# EAGLE schematic nrf52840_four_input_minew_module_v01 (EAGLE 7.7.0)
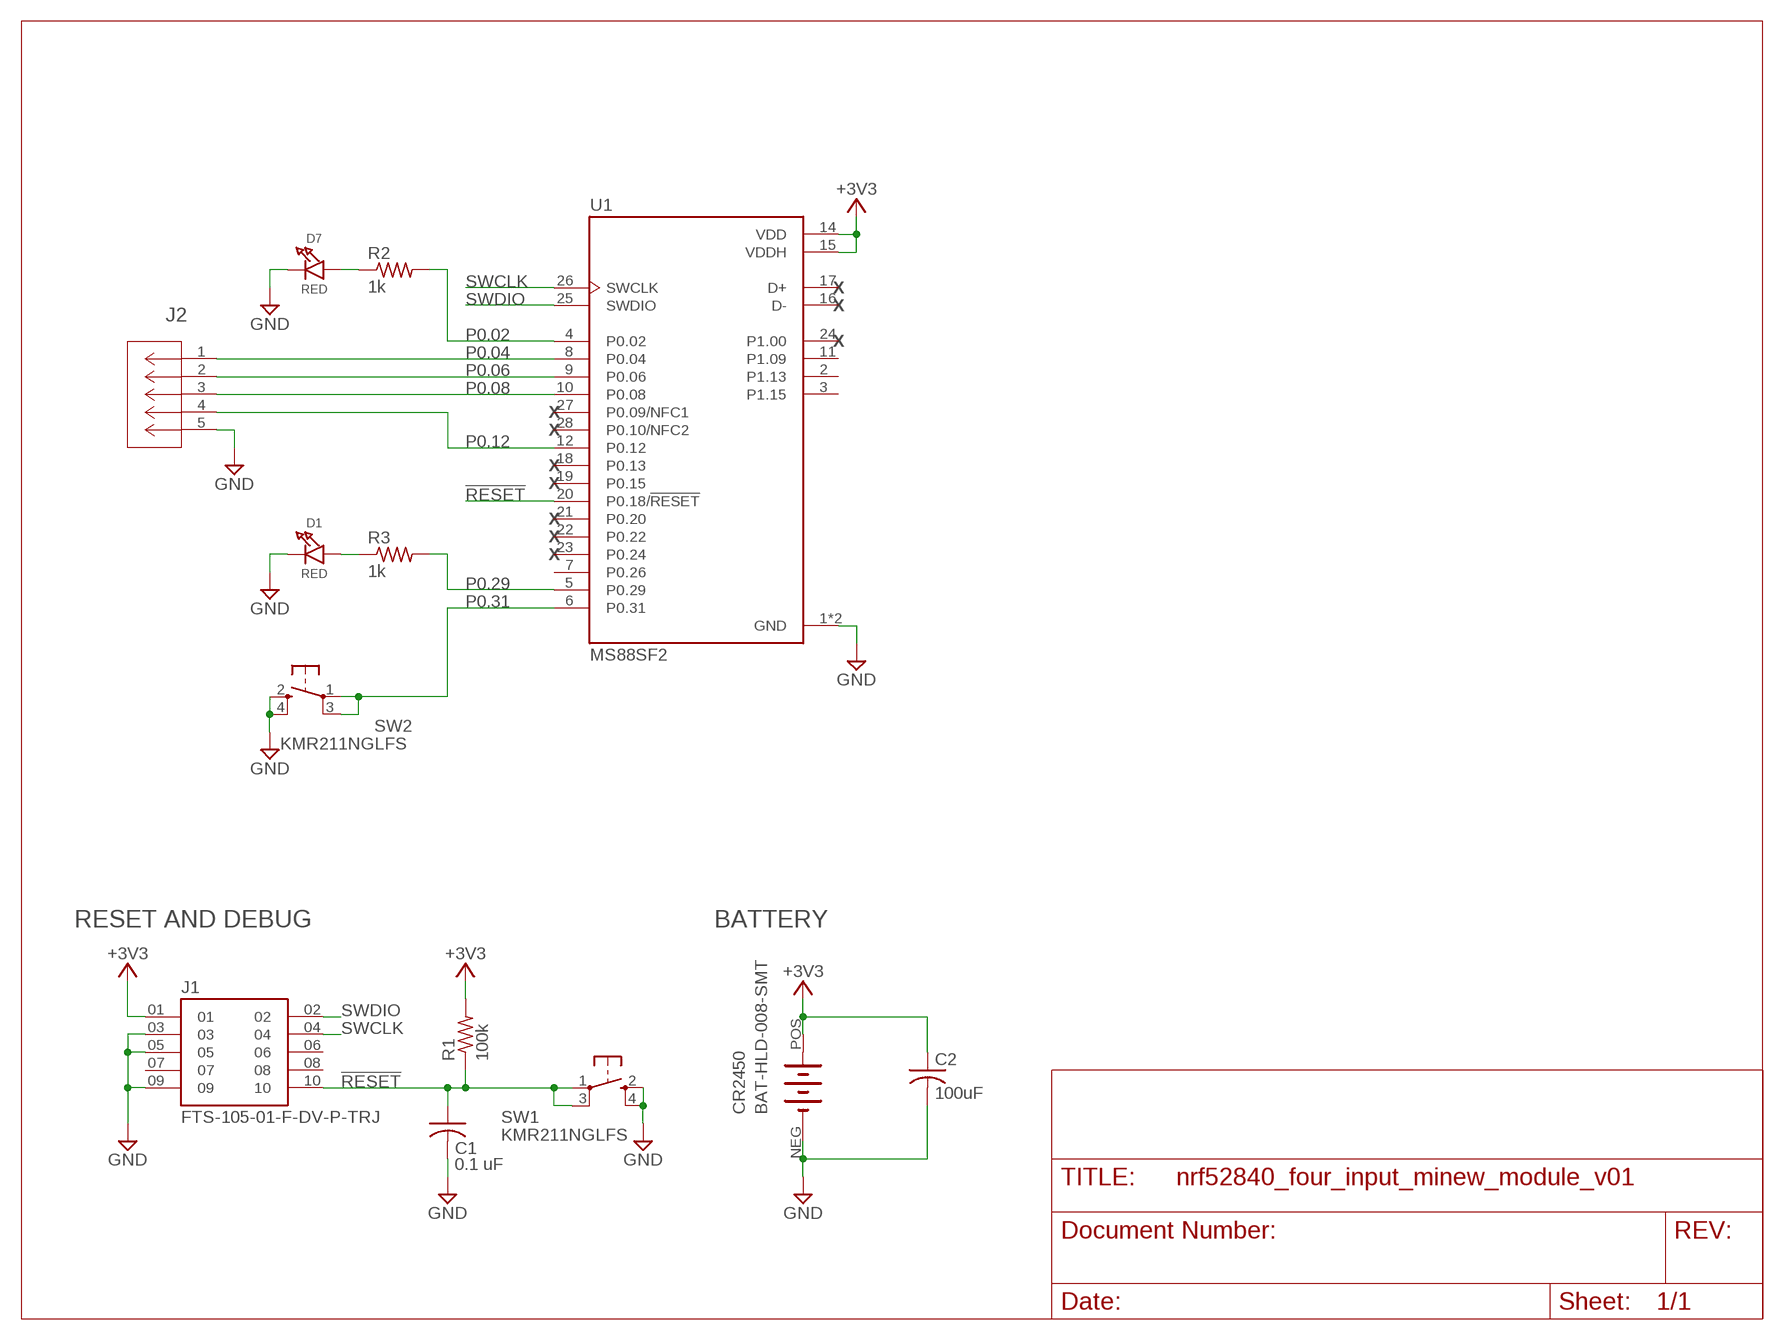
[diagram p0: schematic, sheet 1]

## Parts
C1  0.1 uF  C-USC0603K  [C0603K]
C2  100uF  C-USC1210K  [C1210K]
CR2450  BAT-HLD-008-SMT  [BAT-HLD-008-SMT]
D1  RED  LED0805_NOOUTLINE  [CHIPLED_0805_NOOUTLINE]
D7  RED  LED0805_NOOUTLINE  [CHIPLED_0805_NOOUTLINE]
J1  FTS-105-01-F-DV-P-TRJ  [SAMTEC_FTS-105-01-F-DV-P-TR]
J2  1725685  [CONN_1725685_PXC]
R1  100k  R-US_R0603  [R0603]
R2  1k  R-US_R0603  [R0603]
R3  1k  R-US_R0603  [R0603]
SW1  KMR211NGLFS  SPST_TACT-KMR2  [KMR2]
SW2  KMR211NGLFS  SPST_TACT-KMR2  [KMR2]
U1  MS88SF2  [XCVR_MS88SF2]

## Nets
!RESET: C1.1 J1.10 R1.1 SW1.1(P) SW1.3(P1) U1.20(P0.18/!RESET)
+3V3: C2.1 CR2450.POS(+) J1.01 R1.2 U1.14(VDD) U1.15(VDDH)
GND: C1.2 C2.2 CR2450.NEG(-) D1.C D7.C J1.03 J1.05 J1.09 J2.5 SW1.2(S) SW1.4(S1) SW2.2(S) SW2.4(S1) U1.1(GND) U1.13(GND)
N$2: D7.A R2.1
N$4: D1.A R3.1
P0.02: R2.2 U1.4(P0.02)
P0.04: J2.1 U1.8(P0.04)
P0.06: J2.2 U1.9(P0.06)
P0.08: J2.3 U1.10(P0.08)
P0.12: J2.4 U1.12(P0.12)
P0.29: R3.2 U1.5(P0.29)
P0.31: SW2.1(P) SW2.3(P1) U1.6(P0.31)
SWCLK: J1.04 U1.26(SWCLK)
SWDIO: J1.02 U1.25(SWDIO)
Unconnected: J1.06 J1.07 J1.08 U1.2(P1.13) U1.3(P1.15) U1.7(P0.26) U1.11(P1.09) U1.16(D-) U1.17(D+) U1.18(P0.13) U1.19(P0.15) U1.21(P0.20) U1.22(P0.22) U1.23(P0.24) U1.24(P1.00) U1.27(P0.09/NFC1) U1.28(P0.10/NFC2)

## Notes on the sheet
- X
- X
- X
- X
- X
- X
- X
- X
- X
- X
- RESET AND DEBUG | BATTERY

## Library data of the parts
C1 C2 = rcl:C-US: CAPACITOR, American symbol
CR2450 = BAT-HLD-008-SMT:BAT-HLD-008-SMT
D1 D7 = microbuilder:LED: LED 0603 - 0603 Surface Mount Package 2mA: Green LED - Low Power (3.9mcd, 2ma, 1.7Vf) - Digikey: 475-2709-2-ND Orange LED - Low Power (9.8mcd, 2ma, 1.8Vf) - Digikey: 475-1194-2-ND Red LED - Low Power (5mcd, 2ma, 1.8Vf) - Digikey: 475-1195-2-ND Yellow LED - Low Power (7mcd, 2ma, 1.8Vf) - Digikey: 475-1196-2-ND 5mA: Blue LED - Low Power (17mcd, 5ma, 2.9Vf) - Digikey: LNJ937W8CRACT-ND 0805 - 0805 Surface Mount Package 2mA: Red LED (8.8mcd, 2mA, 1.8Vf, Clear) - Low Power [Digikey: 475-2510-1-ND] Green LED (5mcd, 2mA, 1.8Vf, Clear) - Low Power [Digikey: 475-2730-1-ND] Yellow LED (11.3mcd, 2mA, 1.8Vf, Clear) - Low Power [Digikey: 475-2555-1-ND] 20mA: Red LED (104mcd, 20mA, Diffused) - LS R976 [Digikey: 475-1278-6-ND] Red LED (12mcd, 20mA, 2.0Vf, Clear) - APT2012EC [Digikey: 754-1128-1-ND] Green LED (15mcd, 20mA, 2.2Vf, Clear) - APT2012GC [Digikey: 754-1131-1-ND] Orange LED (160mcd, 20mA, 2.1Vf, Clear) - APT2012SECK [Digikey: 754-1130-1-ND] 1206 - 1206 Surface Mount Package Green LED (26mcd, 20mA, Diffused) - LG N971 [Digikey: 475-1407-6-ND] Red LED (15mcd, 20mA, Diffused) - LH N974 [Digikey: 475-1416-6-ND] Cree - Cree High-Power Surface Mount LEDs XPEBWT-L1-0000-00D50 - White 111lm 350mA 2.9Vf 6200K 110° XTEAWT-00-0000-00000LEE3 - White 114lm 350mA 2.85Vf 5000K 115° Everlight - Everlight 45-21 Series Surface Mount LEDs 45-21/QK2C-B2832AC2CB2/2T - Warm White 2000mcd 20mA 3.25Vf 3050K 120° 45-21/LK2C-B38452C4CB2/2T - Nuetral White 2000mcd 20mA 3.25Vf 4150K 120° 45-21/LK2C-B50634C6CB2/2T - Cold White 2200mcd 20mA 3.25Vf 5650K 120° PLCC2 Reverse Mount LS T77K-J1L2-1-0-2-R18-Z - Red 11.25mcd 2mA 1.8Vf 630nm 120° LO T77K-L1M2-24-Z - Orange 19.6mcd 2mA 1.8Vf 606nm 120° LY T77K-K2M1-26-Z - Yellow 15.7mcd 2mA 1.8Vf 587nm 120°
J1 = FTS-105-01-F-DV-P-TR:FTS-105-01-F-DV-P-TR: Check availability <https://pricing.snapeda.com/parts/FTS-105-01-F-DV-P-TR/Samtec/view-part?ref=eda>; AVAILABILITY: In Stock; DESCRIPTION: FTS - Samtec 1.27mm Micro Header 0.86mm Profile 3.05mm Post; MF: Samtec; MP: FTS-105-01-F-DV-P-TR; PACKAGE: None; PRICE: None; PURCHASE-URL: https://pricing.snapeda.com/search/part/FTS-105-01-F-DV-P-TR/?ref=eda
J2 = PHOENIX-1725685-2.54-1x5:1725685; COPYRIGHT: Copyright (C) 2024 Ultra Librarian. All rights reserved.; MANUFACTURER_PART_NUMBER: 1725685; MFR_NAME: Phoenix Contact
R1-R3 = rcl:R-US_: RESISTOR, American symbol
SW1 SW2 = adafruit:SPST_TACT: SMT 6mm switch, EVQQ2 series http://www.ladyada.net/library/eagle
U1 = MS88SF2:MS88SF2: MS88SF2 is based on Nordic nRF52840 and it is a compact and very small size Bluetooth 5.0 module with the metal cover shield and compliance with IEEE 802.14.4 standard. Check availability <https://pricing.snapeda.com/parts/MS88SF2/Minew/view-part?ref=eda>; AVAILABILITY: Not in stock; CHECK_PRICES: https://www.snapeda.com/parts/MS88SF2/Minew/view-part/?ref=eda; DESCRIPTION: MS88SF2 is based on Nordic nRF52840 and it is a compact and very small size Bluetooth 5.0 module with the metal cover shield and compliance with IEEE 802.14.4 standard.; MF: Minew; MP: MS88SF2; PACKAGE: Package; PRICE: None; SNAPEDA_LINK: https://www.snapeda.com/parts/MS88SF2/Minew/view-part/?ref=snap